# EAGLE design Adafruit AP6302 (EAGLE 6.6.0)
COMPANY: ADAFRUIT INDUSTRIES; DRAWN: KTOWN; REV: A
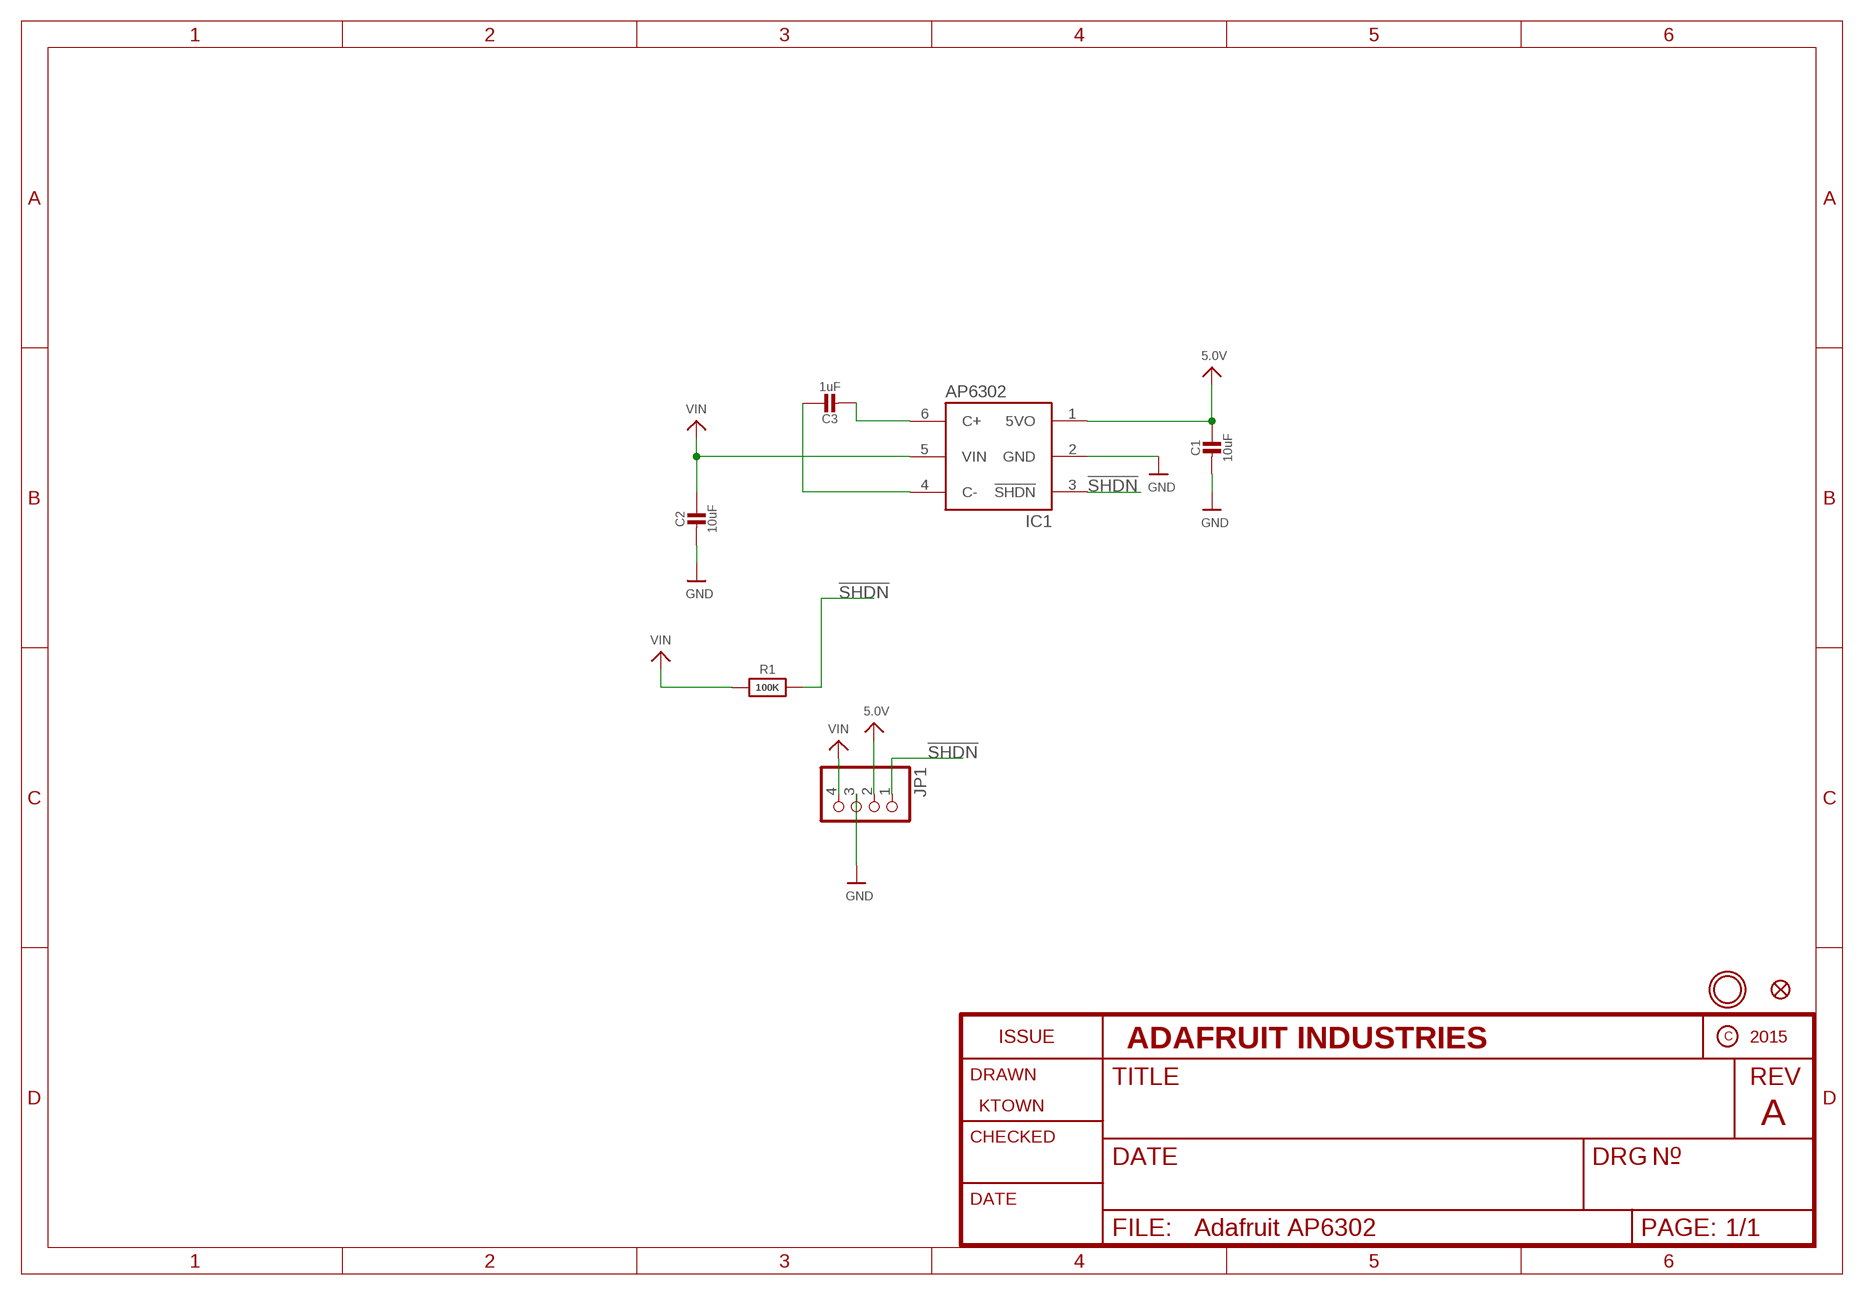
[diagram p0: schematic, sheet 1]

## Parts
C1  10uF  CAP_CERAMIC0805-NOOUTLINE  [0805-NO]
C2  10uF  CAP_CERAMIC0805-NOOUTLINE  [0805-NO]
C3  1uF  CAP_CERAMIC0805-NOOUTLINE  [0805-NO]
FID1  FIDUCIAL""  [FIDUCIAL_1MM]
IC1  AP3602  [SOT23-6]
JP1  HEADER-1X4ROUND  [1X04_ROUND]
R1  100K  RESISTOR0805_NOOUTLINE  [0805-NO]
U$9  MOUNTINGHOLE2.5  [MOUNTINGHOLE_2.5_PLATED]

## Nets
5.0V: C1.1 IC1.1(5VO) JP1.2
!SHDN: IC1.3(!SHDN) JP1.1 R1.2
GND: C1.2 C2.2 IC1.2(GND) JP1.3
N$1: C3.2 IC1.6(C+)
N$2: C3.1 IC1.4(C-)
VIN: C2.1 IC1.5(VIN) JP1.4 R1.1

## Library data of the parts
C1-C3 = microbuilder:CAP_CERAMIC: Ceramic Capacitors For new designs, use the packages preceded by an '_' character since they are more reliable: The following footprints should be used on most boards: _0402 - Standard footprint for regular board layouts _0603 - Standard footprint for regular board layouts _0805 - Standard footprint for regular board layouts _1206 - Standard footprint for regular board layouts For extremely tight-pitch boards where space is at a premium, the following 'micro-pitch' footprints can be used (smaller pads, no silkscreen outline, etc.): _0402MP - Micro-pitch footprint for very dense/compact boards _0603MP - Micro-pitch footprint for very dense/compact boards _0805MP - Micro-pitch footprint for very dense/compact boards _1206MP - Micro-pitch footprint for very dense/compact boards
FID1 = microbuilder:FIDUCIAL: Fiducial Alignment Points Various fiducial points for machine vision alignment.; BOM: EXCLUDE
IC1 = microbuilder:AP3602
JP1 = microbuilder:HEADER-1X4: PIN HEADER
R1 = microbuilder:RESISTOR: Resistors For new designs, use the packages preceded by an '_' character since they are more reliable: The following footprints should be used on most boards: _0402 - Standard footprint for regular board layouts _0603 - Standard footprint for regular board layouts _0805 - Standard footprint for regular board layouts _1206 - Standard footprint for regular board layouts For extremely tight-pitch boards where space is at a premium, the following 'micro-pitch' footprints can be used (smaller pads, no silkscreen outline, etc.): _0402MP - Micro-pitch footprint for very dense/compact boards _0603MP - Micro-pitch footprint for very dense/compact boards _0805MP - Micro-pitch footprint for very dense/compact boards _1206MP - Micro-pitch footprint for very dense/compact boards
U$9 = microbuilder:MOUNTINGHOLE: Mounting Hole For #2 screws (0.086"/2.18mm width, 0.094"/2.4mm hole) use 2.5mm; BOM: EXCLUDE

## Board
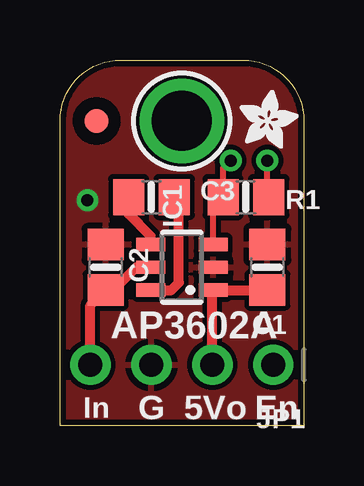
[diagram p1: board, top side]
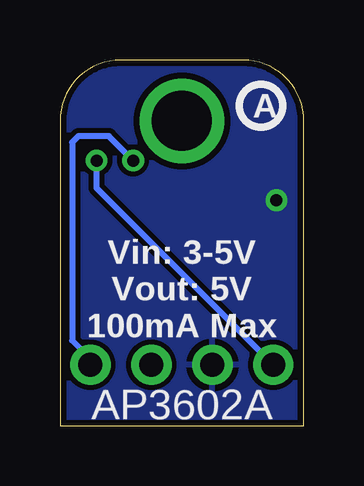
[diagram p2: board, bottom side, seen from below]

Size 10.16 x 15.24 mm. Coordinates in mm from the lower left corner, seen from the top.
Outline: 0,0 0,12.7 arc-90 2.54,15.24 7.62,15.24 arc-90 10.16,12.7 10.16,0 0,0
Copper layers (1*16): Top 0.035mm / dielectric 1.5mm / Bottom 0.035mm
Design rules "adafruit *": minimum track width 8mil, minimum drill 15.5mil, track to track 8mil, track to pad 8mil, pad to pad 8mil, via to via 8mil, smd to smd 8mil, copper to edge 10mil, drill to drill 8mil, minimum pad ring 10mil, minimum via ring 8mil, stop-mask expansion 2mil, vias tented up to drill 20mil, thermal gap 10mil

### Footprints (pad centres in the part's own frame; a part is rotated, then mirrored left to right if it is on the bottom)
0805-NO = smd 1.3 x 1.5: 1 -0.95,0; 2 0.95,0
FIDUCIAL_1MM = smd 1 x 1: 1 0,0
SOT23-6 = smd 0.55 x 1.2: 1 -0.95,-1.3; 2 0,-1.3; 3 0.95,-1.3; 4 0.95,1.3; 5 0,1.3; 6 -0.95,1.3
1X04_ROUND = drill 1 pad 1.676: 1 -3.81,0; 2 -1.27,0; 3 1.27,0; 4 3.81,0
MOUNTINGHOLE_2.5_PLATED = drill 2.5 pad 3.2: P$1 0,0

### Placement (x,y rotation side)
C1  8.64,6.6 90 top
C2  1.91,6.6 90 top
C3  3.81,9.53 0 top
FID1  1.52,12.7 0 top
IC1  5.08,6.6 90 top
JP1  5.08,2.54 180 top
R1  7.75,9.53 180 top
U$9  5.08,12.7 0 top
U$10  [PCBFEAT-REV-040]  1.78,13.34 0 bottom
U$11  [ADAFRUIT_2.5MM]  7.49,11.56 0 top

### Tracks (layer width: path | path; a pad name or v marks a point on that pad's centre or on a via)
5.0V
  Top 0.406: C1.1 IC1.1 6.35,5.62 JP1.2
!SHDN  (via drill 0.5)
  Top 0.254: IC1.3 6.38,9.11 R1.2 6.8,10.73 v7.11,11.05
  Bottom 0.254: v7.11,11.05 8.13,12.06 9.4,12.06 9.65,11.81 9.65,3.56 8.89,2.79 JP1.1
GND  (via drill 0.5)
  other vias: 1.14,9.4
  pour Bottom: 0,15.37 0,0 10.16,0 10.16,15.37
  pour Top: 0,15.37 0,0 10.16,0 10.16,15.37
N$1
  Top 0.406: IC1.6 4.64,5.65 4.95,5.97 4.95,9.33 C3.2
N$2
  Top 0.406: IC1.4 3.78,7.9 2.86,8.82 C3.1
VIN  (via drill 0.5)
  Top 0.254: R1.1 8.64,9.59 v8.64,11.05
  Top 0.406: JP1.4 1.27,5.02 C2.1 2.23,5.65 3.17,6.6 IC1.5
  Bottom 0.254: JP1.4 8.64,9.91 v8.64,11.05

### Text on the board
tPlace: AP3602A | In | G | 5Vo | En
bPlace: Vin: 3-5V / Vout: 5V / 100mA Max | AP3602A